# Altium schematic sheet cereal-sch.SchDoc: Cereal Schematics
size Tabloid; CheckedBy: elerner, jmpenny; Author: dnv; DocumentNumber: N/A; Revision: 1; SheetNumber: 2; SheetTotal: 2
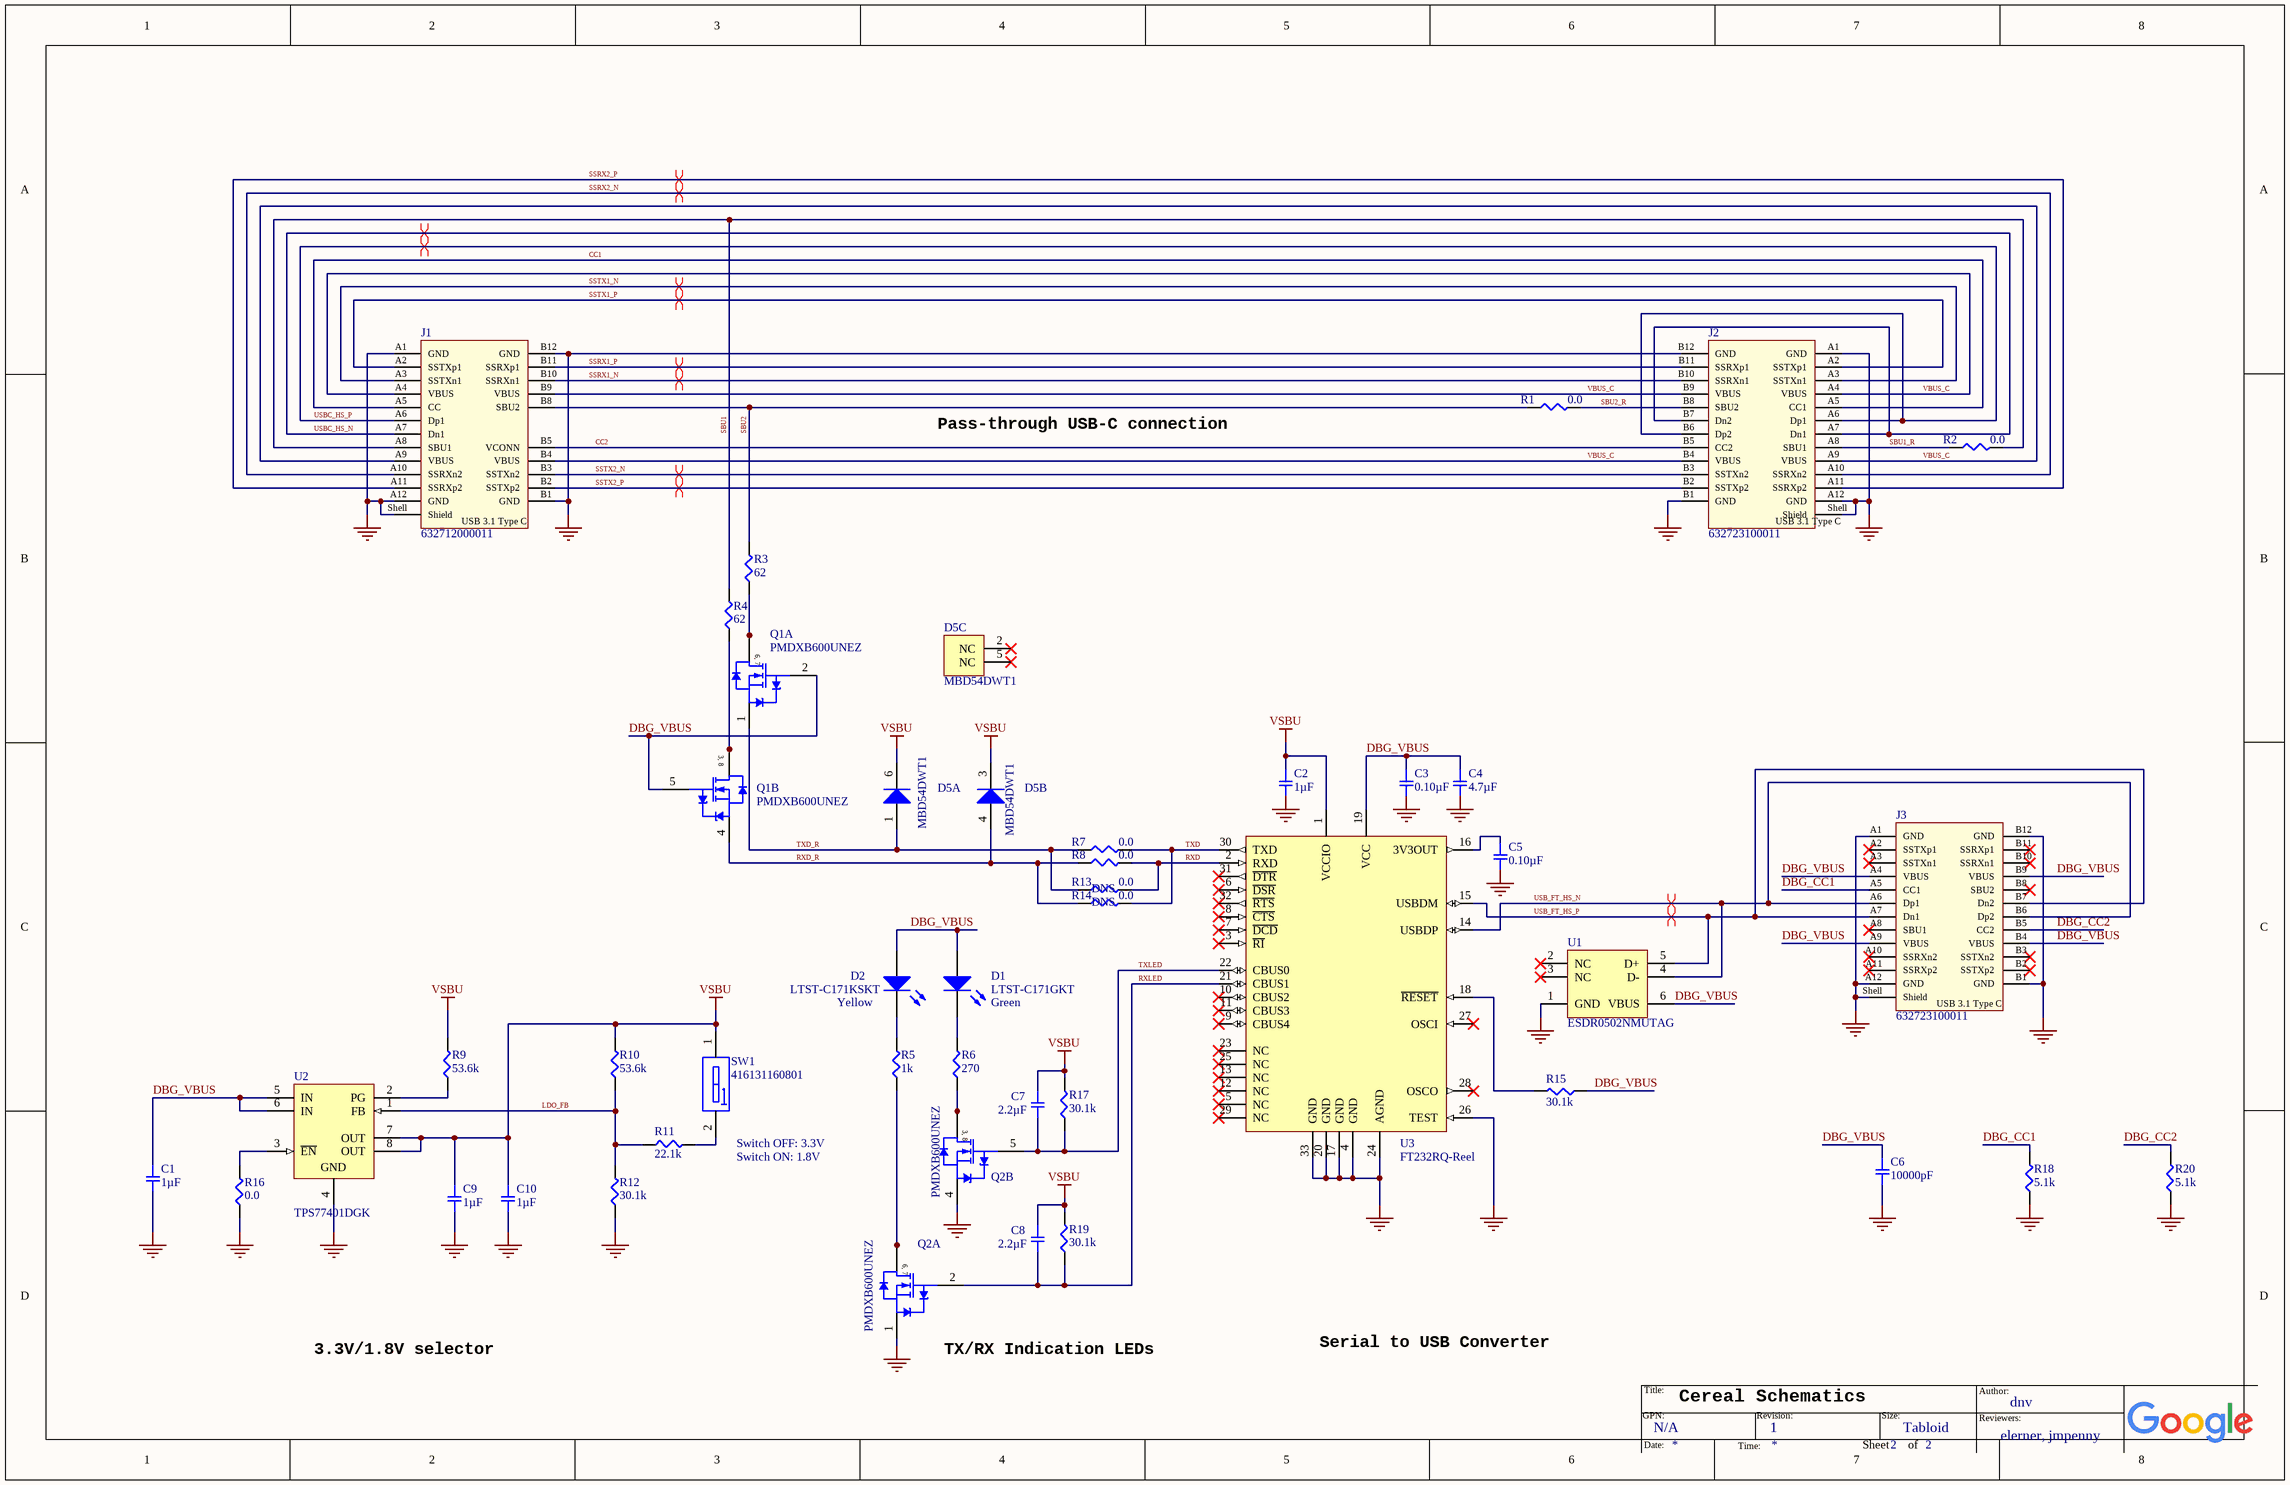
[diagram p0: cereal-sch.SchDoc]

## Parts
C1  1µF  [SMD-0201C]
C2  1µF  [SMD-0201C]
C3  0.10µF  [SMD-0201C]
C4  4.7µF  [SMD-0402C]
C5  0.10µF  [SMD-0201C]
C6  10000pF  [SMD-0201C]
C7  2.2µF  [SMD-0201C]
C8  2.2µF  [SMD-0201C]
C9  1µF  [SMD-0201C]
C10  1µF  [SMD-0201C]
D1  LTST-C171GKT  Color: Green  [0805]
D2  LTST-C171KSKT  Color: Yellow  [0805]
D5  MBD54DWT1  [ONSC-SOT-363-6-419B-02_W_V]  (parts A,B,C of 3)
J1  632712000011  [632712000011]
J2  632723100011  [632723100011]
J3  632723100011  [632723100011]
Q1  PMDXB600UNEZ  [NXP-SOT1216_N]  (parts A,B of 2)
Q2  PMDXB600UNEZ  [NXP-SOT1216_N]  (parts A,B of 2)
R1  0.0  [SMD-0201-RES]
R2  0.0  [SMD-0201-RES]
R3  62  [SMD-0402-RES]
R4  62  [SMD-0402-RES]
R5  1k  [SMD-0201-RES]
R6  270  [SMD-0201-RES]
R7  0.0  [SMD-0201-RES]
R8  0.0  [SMD-0201-RES]
R9  53.6k  [SMD-0201-RES]
R10  53.6k  [SMD-0201-RES]
R11  22.1k  [SMD-0201-RES]
R12  30.1k  [SMD-0201-RES]
R13  0.0  Populate: DNS  [SMD-0201-RES]
R14  0.0  Populate: DNS  [SMD-0201-RES]
R15  30.1k  [SMD-0201-RES]
R16  0.0  [SMD-0201-RES]
R17  30.1k  [SMD-0201-RES]
R18  5.1k  [SMD-0201-RES]
R19  30.1k  [SMD-0201-RES]
R20  5.1k  [SMD-0201-RES]
SW1  416131160801  [416131160801]
U1  ESDR0502NMUTAG  [ONSC-UDFN-6-517AA-01_V]
U2  TPS77401DGK  [TI-DGK8_N]
U3  FT232RQ-Reel  [PQFN5X5-32_V]

## Nets
GND: C1.2 C2.2 C3.2 C4.2 C5.2 C6.2 C9.2 C10.2 J1.A1(GND) J1.A12(GND) J1.B1(GND) J1.B12(GND) J1.Shell(Shield) J2.A1(GND) J2.A12(GND) J2.B1(GND) J2.B12(GND) J2.Shell(Shield) J3.A1(GND) J3.A12(GND) J3.B1(GND) J3.B12(GND) J3.Shell(Shield) Q2.1(S1) Q2.4(S2) R12.1 R16.1 R18.1 R20.1 U1.1(GND) U2.4(GND) U3.4(GND) U3.17(GND) U3.20(GND) U3.24(AGND) U3.26(TEST) U3.33(GND)
VSBU: C2.1 C7.1 C8.1 C9.1 C10.1 D5.3(K1) D5.6(K2) R9.2 R10.2 R17.2 R19.2 SW1.1 U2.7(OUT) U2.8(OUT) U3.1(VCCIO)
CC1: J1.A5(CC) J2.A5(CC1)
CC2: J1.B5(VCONN) J2.B5(CC2)
DBG_CC1: J3.A5(CC1) R18.2
DBG_CC2: J3.B5(CC2) R20.2
DBG_VBUS: C1.1 C3.1 C4.1 C6.1 D1.1(A) D2.1(A) J3.A4(VBUS) J3.A9(VBUS) J3.B4(VBUS) J3.B9(VBUS) Q1.2(G1) Q1.5(G2) R15.1 U1.6(VBUS) U2.5(IN) U2.6(IN) U3.19(VCC)
LDO_FB: R10.1 R11.1 R12.2 U2.1(FB)
RXD: R8.2 R13.2 U3.2(RXD)
RXD_R: D5.4(A1) Q1.4(S2) R8.1 R14.1
RXLED: C8.2 Q2.2(G1) R19.1 U3.21(CBUS1)
SBU1: J1.A8(SBU1) R2.2 R4.2
SBU1_R: J2.A8(SBU1) R2.1
SBU2: J1.B8(SBU2) R1.1 R3.2
SBU2_R: J2.B8(SBU2) R1.2
SSRX1_N: J1.B10(SSRXn1) J2.B10(SSRXn1)
SSRX1_P: J1.B11(SSRXp1) J2.B11(SSRXp1)
SSRX2_N: J1.A10(SSRXn2) J2.A10(SSRXn2)
SSRX2_P: J1.A11(SSRXp2) J2.A11(SSRXp2)
SSTX1_N: J1.A3(SSTXn1) J2.A3(SSTXn1)
SSTX1_P: J1.A2(SSTXp1) J2.A2(SSTXp1)
SSTX2_N: J1.B3(SSTXn2) J2.B3(SSTXn2)
SSTX2_P: J1.B2(SSTXp2) J2.B2(SSTXp2)
TXD: R7.2 R14.2 U3.30(TXD)
TXD_R: D5.1(A2) Q1.1(S1) R7.1 R13.1
TXLED: C7.2 Q2.5(G2) R17.1 U3.22(CBUS0)
USB_FT_HS_N: J3.A6(Dp1) J3.B6(Dp2) U1.4(D-) U3.14(USBDP)
USB_FT_HS_P: J3.A7(Dn1) J3.B7(Dn2) U1.5(D+) U3.15(USBDM)
USBC_HS_N: J1.A7(Dn1) J2.A7(Dn1) J2.B7(Dn2)
USBC_HS_P: J1.A6(Dp1) J2.A6(Dp1) J2.B6(Dp2)
VBUS_C: J1.A4(VBUS) J1.A9(VBUS) J1.B4(VBUS) J1.B9(VBUS) J2.A4(VBUS) J2.A9(VBUS) J2.B4(VBUS) J2.B9(VBUS)
NetC5_1: C5.1 U3.16(3V3OUT)
NetD1_2: D1.2(K) R6.2
NetD2_2: D2.2(K) R5.2
NetQ1_3: Q1.3(D2) Q1.8(D2) R4.1
NetQ1_6: Q1.6(D1) Q1.7(D1) R3.1
NetQ2_3: Q2.3(D2) Q2.8(D2) R6.1
NetQ2_6: Q2.6(D1) Q2.7(D1) R5.1
NetR9_1: R9.1 U2.2(PG)
NetR11_2: R11.2 SW1.2
NetR15_2: R15.2 U3.18(~{RESET})
NetR16_2: R16.2 U2.3(~{EN})

Not connected (* = marked no-connect by the designer): D5 2(NC)* 5(NC)*; J3 A2(SSTXp1)* A3(SSTXn1)* A8(SBU1)* A10(SSRXn2)* A11(SSRXp2)* B2(SSTXp2)* B3(SSTXn2)* B8(SBU2)* B10(SSRXn1)* B11(SSRXp1)*; U1 2(NC)* 3(NC)*; U3 3(~{RI})* 5(NC)* 6(~{DSR})* 7(~{DCD})* 8(~{CTS})* 9(CBUS4)* 10(CBUS2)* 11(CBUS3)* 12(NC)* 13(NC)* 23(NC)* 25(NC)* 27(OSCI)* 28(OSCO)* 29(NC)* 31(~{DTR})* 32(~{RTS})*

## Layout directives
differential pair: SSRX1_N, SSRX1_P, SSRX2_N, SSRX2_P, SSTX1_N, SSTX1_P, SSTX2_N, SSTX2_P, USB_FT_HS_N, USB_FT_HS_P, USBC_HS_N, USBC_HS_P

## Notes on the sheet
- Pass-through USB-C connection
- Switch OFF: 3.3V
- Switch ON: 1.8V
- 3.3V/1.8V selector
- (near Q2) TX/RX Indication LEDs
- Serial to USB Converter
- GPN:
- Title:
- Revision:
- Size:
- Tabloid
- Author:
- Reviewers:
- Date:
- Time:
- Sheet
- of
- (in symbol 632712000011) USB 3.1 Type C
- (in symbol 632723100011) USB 3.1 Type C
- (in symbol PMDXB600UNEZ, part A) 6, 7
- (in symbol PMDXB600UNEZ, part B) 3, 8

## Library data of the parts
C1 C2 C9 C10 = GRM033R60J105MEA2D: CAP CER 1UF 6.3V X5R 0201; Manufacturer: Murata Electronics North America; Factory Stock: 0; Unit Price (USD): 0.12; Minimum Quantity: 1; Tolerance: ±20%; Datasheets: http://www.murata.com/~/media/webrenewal/support/library/catalog/products/capacitor/mlcc/c02e.pdf; Image: //media.digikey.com/Renders/Murata%20Renders/ZRB-SERIES-0402.jpg; Digi-Key Part Number: 490-7229-1-ND; Part Number: GRM033R60J105MEA2D; Quantity Available: 223818; @ qty: 0; Packaging: Cut Tape (CT); Series: GRM; Part Status: Active; Value: 1µF; Voltage: 6.3V; Temperature Coefficient: X5R; Operating Temperature: -55°C ~ 85°C; Features: Derating Recommended; Ratings: -; Applications: General Purpose; Failure Rate: Surface Mount, MLCC; Mounting Type: 0201 (0603 Metric); Package / Case: 0.024" L x 0.012" W (0.60mm x 0.30mm); Size / Dimension: -; Height - Seated (Max): 0.013" (0.33mm); Thickness (Max): -; Lead Spacing: -
C3 C5 = GRM033R61A104KE15D: CAP CER 0.1UF 10V X5R 0201; Manufacturer: Murata Electronics North America; Factory Stock: 0; Unit Price (USD): 0.1; Minimum Quantity: 1; Tolerance: ±10%; Datasheets: http://www.murata.com/~/media/webrenewal/support/library/catalog/products/capacitor/mlcc/c02e.pdf; Image: //media.digikey.com/Renders/Murata%20Renders/ZRB-SERIES-0402.jpg; Digi-Key Part Number: 490-5881-1-ND; Part Number: GRM033R61A104KE15D; Quantity Available: 6540866; @ qty: 0; Packaging: Cut Tape (CT); Series: GRM; Part Status: Active; Value: 0.10µF; Voltage: 10V; Temperature Coefficient: X5R; Operating Temperature: -55°C ~ 85°C; Features: -; Ratings: -; Applications: General Purpose; Failure Rate: Surface Mount, MLCC; Mounting Type: 0201 (0603 Metric); Package / Case: 0.024" L x 0.012" W (0.60mm x 0.30mm); Size / Dimension: -; Height - Seated (Max): 0.013" (0.33mm); Thickness (Max): -; Lead Spacing: -
C4 = GRM153R60G475ME15D: CAP CER 4.7UF 4V X5R 0402; Manufacturer: Murata Electronics North America; Factory Stock: 0; Unit Price (USD): 0.27; Minimum Quantity: 1; Tolerance: ±20%; Datasheets: http://psearch.en.murata.com/capacitor/product/GRM153R60G475ME15%23.pdf; Image: //media.digikey.com/Renders/Murata%20Renders/ZRB-SERIES-0402.jpg; Digi-Key Part Number: 490-13231-1-ND; Part Number: GRM153R60G475ME15D; Quantity Available: 9100; @ qty: 0; Packaging: Cut Tape (CT); Series: GRM; Part Status: Active; Value: 4.7µF; Voltage: 4V; Temperature Coefficient: X5R; Operating Temperature: -55°C ~ 85°C; Features: -; Ratings: -; Applications: General Purpose; Mounting Type: Surface Mount, MLCC; Package / Case: 0402 (1005 Metric); Size / Dimension: 0.039" L x 0.020" W (1.00mm x 0.50mm); Height - Seated (Max): -; Thickness (Max): 0.013" (0.33mm); Lead Spacing: -; Lead Style: -
C6 = GRM033R61A103KA01J: CAP CER 10000PF 10V X5R 0201; Manufacturer: Murata Electronics North America; Factory Stock: 0; Unit Price (USD): 0.1; Minimum Quantity: 1; Tolerance: ±10%; Datasheets: http://www.murata.com/~/media/webrenewal/support/library/catalog/products/capacitor/mlcc/c02e.pdf; Image: //media.digikey.com/Renders/Murata%20Renders/ZRB-SERIES-0402.jpg; Digi-Key Part Number: 490-8156-1-ND; Part Number: GRM033R61A103KA01J; Quantity Available: 134975; @ qty: 0; Packaging: Cut Tape (CT); Series: GRM; Part Status: Active; Value: 10000pF; Voltage: 10V; Temperature Coefficient: X5R; Operating Temperature: -55°C ~ 85°C; Features: -; Ratings: -; Applications: General Purpose; Failure Rate: Surface Mount, MLCC; Mounting Type: 0201 (0603 Metric); Package / Case: 0.024" L x 0.012" W (0.60mm x 0.30mm); Size / Dimension: -; Height - Seated (Max): 0.013" (0.33mm); Thickness (Max): -; Lead Spacing: -
C7 C8 = GRM033R61A225KE47D: CAP CER 2.2UF 10V X5R 0201; Manufacturer: Murata Electronics North America; Factory Stock: 0; Unit Price (USD): 0.28; Minimum Quantity: 1; Tolerance: ±10%; Datasheets: http://www.murata.com/~/media/webrenewal/support/library/catalog/products/capacitor/mlcc/c02e.pdf; Image: //media.digikey.com/Renders/Murata%20Renders/ZRB-SERIES-0402.jpg; Digi-Key Part Number: 490-13227-1-ND; Part Number: GRM033R61A225KE47D; Quantity Available: 8; @ qty: 0; Packaging: Cut Tape (CT); Series: GRM; Part Status: Active; Value: 2.2µF; Voltage: 10V; Temperature Coefficient: X5R; Operating Temperature: -55°C ~ 85°C; Features: Derating Recommended; Ratings: -; Applications: General Purpose; Failure Rate: Surface Mount, MLCC; Mounting Type: 0201 (0603 Metric); Package / Case: 0.024" L x 0.012" W (0.60mm x 0.30mm); Size / Dimension: -; Height - Seated (Max): 0.015" (0.39mm); Thickness (Max): -; Lead Spacing: -
D1 = LTST-C171GKT: LED
D2 = LTST-C171KSKT: LED
D5 = MBD54DWT1: Dual Schottky Barrier Diodes, 6-Pin SOT-363, Tape and Reel; Manufacturer: On Semiconductor; IFSM Max (A): 0.6; trr Max (ns): 5; DatasheetVersion: Rev. 7; PackageVersion: Rev. W, 01/2006; PackageReference: SOT-363-6-419B-02_W; PackageDescription: 6-Pin Small Outline Transistor, Body 2 x 1.25 mm, Pitch 0.65 mm; Supplier 1: Digi-Key; Supplier Part Number 1: MBD54DWT1OSCT-ND; Configuration: Dual; Packing: Tape and Reel; RoHS: FALSE; Mounting Technology: Surface Mount; PartNumber: MBD54DWT1; ComponentLink1Description: Manufacturer URL; ComponentLink1URL: http://www.onsemi.com/; ComponentLink2Description: Datasheet; ComponentLink2URL: http://www.onsemi.cn/pub_link/Collateral/MBD54DWT1-D.PDF; ComponentLink3Description: Package Specification; ComponentLink3URL: http://www.onsemi.com/pub_link/Collateral/NTJD4001N-D.PDF
J1 = 632712000011: USB 3.1 Type C Plug Horizontal SMT WR-COM; Interface Type: Type C; Sub-Family: USB 3.1; ComponentLink1Description: Manufacturer; ComponentLink1URL: http://www.we-online.de; ComponentLink2Description: Datasheet; ComponentLink2URL: http://katalog.we-online.de/em/datasheet/632712000011.pdf; Part Number: 632712000011; Published Date: April 2017; Publisher: Wurth Elektronik; Gender: Plug; Type: Horizontal; Construction: SMT
J2 J3 = 632723100011: USB 3.1 Type C Receptacle Horizontal THR WR-COM; Interface Type: Type C; Sub-Family: USB 3.1; ComponentLink1Description: Manufacturer; ComponentLink1URL: http://www.we-online.de; ComponentLink2Description: Datasheet; ComponentLink2URL: http://katalog.we-online.de/em/datasheet/632723x00011.pdf; Part Number: 632723100011; Published Date: April 2017; Publisher: Wurth Elektronik; Gender: Receptacle; Type: Horizontal; Construction: THR
Q1 Q2 = PMDXB600UNEZ: Dual N-Channel Trench MOSFET, 20 V, 0.6 A, -55 to 150 degC, 8-Pin SOT1216; Manufacturer: NXP Semiconductors; Channel Type: N; Ciss [typ] (pF): 21.3; Coss [typ] (pF): 5.4; ID [max] (A): 0.6; VDS [max] (V): 20; VGSth [typ] (V): 0.7; DatasheetVersion: Rev. 1; PackageVersion: 13-03-06, 03/2013; PackageReference: SOT1216; PackageDescription: 6-Pin Small Outline No-Lead, Body 1.1 x 1 mm, Pitch 0.35 mm; Supplier 1: Digi-Key; Supplier Part Number 1: PMDXB600UNEZ-ND; Supplier 2: Newark; Supplier Part Number 2: 23X8428; Supplier 3: Mouser; Supplier Part Number 3: 771-PMDXB600UNEZ; Mounting Technology: Surface Mount; PartNumber: PMDXB600UNEZ; ComponentLink1Description: Manufacturer URL; ComponentLink1URL: http://www.nxp.com/; ComponentLink2Description: Datasheet; ComponentLink2URL: http://www.nxp.com/documents/data_sheet/PMDXB600UNE.pdf; ComponentLink3Description: Package Specification; ComponentLink3URL: http://www.nxp.com/documents/outline_drawing/sot1216_po.pdf
R1 R2 R7 R8 R13 R14 R16 = ERJ-1GN0R00C: RES SMD 0.0OHM JUMPER 1/20W 0201; Manufacturer: Panasonic Electronic Components; Factory Stock: 0; Unit Price (USD): 0.00864; @ qty: 1500; Minimum Quantity: 1; Power (Watts): 0.05W, 1/20W; Part Number: ERJ-1GN0R00C; Datasheets: http://industrial.panasonic.com/www-cgi/jvcr13pz.cgi?E+PZ+3+AOA0001+ERJ1GN0R00C+8+WW; Image: //media.digikey.com/Renders/Panasonic%20Renders/ERJ-0201%20Pkg.jpg; Digi-Key Part Number: P15979CT-ND; Quantity Available: 1815300; Packaging: Cut Tape (CT); Series: ERJ; Part Status: Active; Value: 0.0; Tolerance: Jumper; Composition: Thick Film; Features: Automotive AEC-Q200; Temperature Coefficient: -; Operating Temperature: -55°C ~ 125°C; Package / Case: 0201 (0603 Metric); Supplier Device Package: 0201; Size / Dimension: 0.024" L x 0.012" W (0.60mm x 0.30mm); Height - Seated (Max): 0.010" (0.26mm); Number of Terminations: 2; Failure Rate: -
R3 R4 = ERJ-2GEJ620X: RES SMD 62 OHM 5% 1/10W 0402; Manufacturer: Panasonic Electronic Components; Factory Stock: 0; Unit Price (USD): 0.00350; @ qty: 1500; Minimum Quantity: 1; Power (Watts): 0.1W, 1/10W; Temperature Coefficient: ±200ppm/°C; Part Number: ERJ-2GEJ620X; Datasheets: http://industrial.panasonic.com/www-cgi/jvcr13pz.cgi?E+PZ+3+AOA0001+ERJ2GEJ620X+7+WW; Image: //media.digikey.com/Photos/Panasonic%20Photos/ERJ-PA2-Series.jpg; Digi-Key Part Number: P62JCT-ND; Quantity Available: 429144; Packaging: Cut Tape (CT); Series: ERJ; Part Status: Active; Value: 62; Tolerance: ±5%; Composition: Thick Film; Features: Automotive AEC-Q200; Operating Temperature: -55°C ~ 155°C; Package / Case: 0402 (1005 Metric); Supplier Device Package: 0402; Size / Dimension: 0.039" L x 0.020" W (1.00mm x 0.50mm); Height - Seated (Max): 0.016" (0.40mm); Number of Terminations: 2; Failure Rate: -
R5 = ERJ-1GEF1001C: RES SMD 1K OHM 1% 1/20W 0201; Manufacturer: Panasonic Electronic Components; Factory Stock: 0; Unit Price (USD): 0.00933; @ qty: 1500; Minimum Quantity: 1; Power (Watts): 0.05W, 1/20W; Temperature Coefficient: ±200ppm/°C; Part Number: ERJ-1GEF1001C; Datasheets: //media.digikey.com/pdf/Data%20Sheets/Panasonic%20Resistors%20Thermistors%20PDFs/ERJ_G,R,E_Rev08.pdf; Image: //media.digikey.com/Renders/Panasonic%20Renders/ERJ-0201%20Pkg.jpg; Digi-Key Part Number: P1.00KABCT-ND; Quantity Available: 359548; Packaging: Cut Tape (CT); Series: ERJ; Part Status: Active; Value: 1k; Tolerance: ±1%; Composition: Thick Film; Features: -; Operating Temperature: -55°C ~ 125°C; Package / Case: 0201 (0603 Metric); Supplier Device Package: 0201; Size / Dimension: 0.024" L x 0.012" W (0.60mm x 0.30mm); Height - Seated (Max): 0.010" (0.26mm); Number of Terminations: 2; Failure Rate: -
R6 = ERJ-1GEF2700C: RES SMD 270 OHM 1% 1/20W 0201; Manufacturer: Panasonic Electronic Components; Factory Stock: 0; Unit Price (USD): 0.00933; @ qty: 1500; Minimum Quantity: 1; Power (Watts): 0.05W, 1/20W; Temperature Coefficient: ±200ppm/°C; Part Number: ERJ-1GEF2700C; Datasheets: //media.digikey.com/pdf/Data%20Sheets/Panasonic%20Resistors%20Thermistors%20PDFs/ERJ_G,R,E_Rev08.pdf; Image: //media.digikey.com/Renders/Panasonic%20Renders/ERJ-0201%20Pkg.jpg; Digi-Key Part Number: P270ABCT-ND; Quantity Available: 19115; Packaging: Cut Tape (CT); Series: ERJ; Part Status: Active; Value: 270; Tolerance: ±1%; Composition: Thick Film; Features: -; Operating Temperature: -55°C ~ 125°C; Package / Case: 0201 (0603 Metric); Supplier Device Package: 0201; Size / Dimension: 0.024" L x 0.012" W (0.60mm x 0.30mm); Height - Seated (Max): 0.010" (0.26mm); Number of Terminations: 2; Failure Rate: -
R9 R10 = ERJ-1GEF5362C: RES SMD 53.6K OHM 1% 1/20W 0201; Manufacturer: Panasonic Electronic Components; Factory Stock: 0; Unit Price (USD): 0.00933; @ qty: 1500; Minimum Quantity: 1; Power (Watts): 0.05W, 1/20W; Temperature Coefficient: ±200ppm/°C; Part Number: ERJ-1GEF5362C; Datasheets: //media.digikey.com/pdf/Data%20Sheets/Panasonic%20Resistors%20Thermistors%20PDFs/ERJ_G,R,E_Rev08.pdf; Image: //media.digikey.com/Renders/Panasonic%20Renders/ERJ-0201%20Pkg.jpg; Digi-Key Part Number: P53.6KABCT-ND; Quantity Available: 73542; Packaging: Cut Tape (CT); Series: ERJ; Part Status: Active; Value: 53.6k; Tolerance: ±1%; Composition: Thick Film; Features: -; Operating Temperature: -55°C ~ 125°C; Package / Case: 0201 (0603 Metric); Supplier Device Package: 0201; Size / Dimension: 0.024" L x 0.012" W (0.60mm x 0.30mm); Height - Seated (Max): 0.010" (0.26mm); Number of Terminations: 2; Failure Rate: -
R11 = ERJ-1GEF2212C: RES SMD 22.1K OHM 1% 1/20W 0201; Manufacturer: Panasonic Electronic Components; Factory Stock: 0; Unit Price (USD): 0.00933; @ qty: 1500; Minimum Quantity: 1; Power (Watts): 0.05W, 1/20W; Temperature Coefficient: ±200ppm/°C; Part Number: ERJ-1GEF2212C; Datasheets: //media.digikey.com/pdf/Data%20Sheets/Panasonic%20Resistors%20Thermistors%20PDFs/ERJ_G,R,E_Rev08.pdf; Image: //media.digikey.com/Renders/Panasonic%20Renders/ERJ-0201%20Pkg.jpg; Digi-Key Part Number: P22.1KABCT-ND; Quantity Available: 91674; Packaging: Cut Tape (CT); Series: ERJ; Part Status: Active; Value: 22.1k; Tolerance: ±1%; Composition: Thick Film; Features: -; Operating Temperature: -55°C ~ 125°C; Package / Case: 0201 (0603 Metric); Supplier Device Package: 0201; Size / Dimension: 0.024" L x 0.012" W (0.60mm x 0.30mm); Height - Seated (Max): 0.010" (0.26mm); Number of Terminations: 2; Failure Rate: -
R12 R15 R17 R19 = ERJ-1GEF3012C: RES SMD 30.1K OHM 1% 1/20W 0201; Manufacturer: Panasonic Electronic Components; Factory Stock: 0; Unit Price (USD): 0.00933; @ qty: 1500; Minimum Quantity: 1; Power (Watts): 0.05W, 1/20W; Temperature Coefficient: ±200ppm/°C; Part Number: ERJ-1GEF3012C; Datasheets: //media.digikey.com/pdf/Data%20Sheets/Panasonic%20Resistors%20Thermistors%20PDFs/ERJ_G,R,E_Rev08.pdf; Image: //media.digikey.com/Renders/Panasonic%20Renders/ERJ-0201%20Pkg.jpg; Digi-Key Part Number: P30.1KABCT-ND; Quantity Available: 121183; Packaging: Cut Tape (CT); Series: ERJ; Part Status: Active; Value: 30.1k; Tolerance: ±1%; Composition: Thick Film; Features: -; Operating Temperature: -55°C ~ 125°C; Package / Case: 0201 (0603 Metric); Supplier Device Package: 0201; Size / Dimension: 0.024" L x 0.012" W (0.60mm x 0.30mm); Height - Seated (Max): 0.010" (0.26mm); Number of Terminations: 2; Failure Rate: -
R18 R20 = ERJ-1GEF5101C: RES SMD 5.1K OHM 1% 1/20W 0201; Manufacturer: Panasonic Electronic Components; Factory Stock: 0; Unit Price (USD): 0.00933; @ qty: 1500; Minimum Quantity: 1; Power (Watts): 0.05W, 1/20W; Temperature Coefficient: ±200ppm/°C; Part Number: ERJ-1GEF5101C; Datasheets: //media.digikey.com/pdf/Data%20Sheets/Panasonic%20Resistors%20Thermistors%20PDFs/ERJ_G,R,E_Rev08.pdf; Image: //media.digikey.com/Renders/Panasonic%20Renders/ERJ-0201%20Pkg.jpg; Digi-Key Part Number: P5.10KABCT-ND; Quantity Available: 106914; Packaging: Cut Tape (CT); Series: ERJ; Part Status: Active; Value: 5.1k; Tolerance: ±1%; Composition: Thick Film; Features: -; Operating Temperature: -55°C ~ 125°C; Package / Case: 0201 (0603 Metric); Supplier Device Package: 0201; Size / Dimension: 0.024" L x 0.012" W (0.60mm x 0.30mm); Height - Seated (Max): 0.010" (0.26mm); Number of Terminations: 2; Failure Rate: -
SW1 = 416131160801: WS-DISV 1.27 mm small compact SMD Dip Switch with top tape; NoPins: 02; PackageReference: 416131160801; PartNumber: 416131160801; ComponentLink1Description: Manufacturer URL; ComponentLink1URL: http://www.we-online.com; ComponentLink2Description: Datasheet; ComponentLink2URL: http://katalog.we-online.de/em/datasheet/4161311608xx.pdf
U1 = ESDR0502NMUTAG: Ultra Low Capacitance ESD Protection Array for High Speed Data Line Protection, 6-Pin UDFN, Pb-Free, Tape and Reel; Manufacturer: On Semiconductor; C Max (pF): 0.6; Direction: Unidirectional; IR Max (uA): 1; Number of Lines: 4; PPK Max (W): 100; V(BR) Min (V): 6; VRWM Max (V): 5.5; DatasheetVersion: Rev. 4; PackageVersion: Rev. D, 09/2010; PackageReference: UDFN-6-517AA-01; PackageDescription: 6-Pin Small Outline No-Lead, Body 1.2 x 1 mm, Pitch 0.4 mm; Supplier 1: Newark; Supplier Part Number 1: 92T2061; Supplier 2: Mouser; Supplier Part Number 2: 863-ESDR0502NMUTAG; Packing: Tape and Reel; RoHS: Pb-Free; Mounting Technology: Surface Mount; PartNumber: ESDR0502NMUTAG; ComponentLink1Description: Manufacturer URL; ComponentLink1URL: http://www.onsemi.com/; ComponentLink2Description: Datasheet; ComponentLink2URL: http://www.onsemi.cn/pub_link/Collateral/ESDR0502N-D.PDF; ComponentLink3Description: Package Specification; ComponentLink3URL: http://www.onsemi.com/pub_link/Collateral/517AA.PDF
U2 = TPS77401DGK: Single Output Fast Transient Response LDO, 250 mA, Adjustable 1.5 to 5.5 V Output, 2.7 to 10 V Input, with Power Good Output, 8-pin MSOP (DGK), -40 to 125 degC, Green (RoHS & no Sb/Br); Manufacturer: Texas Instruments; Accuracy(%): 2; Iout(Max)(A): 0.25; Iq(Typ)(mA): 0.09; Power Good: TRUE; SubFamily: Single Channel LDO; Vdo(Typ)(mV): 200; Vin(Max)(V): 10; Vin(Min)(V): 2.7; Vout Adj(Max)(V): 5.5; Vout Adj(Min)(V): 1.5; DatasheetVersion: SLVS281E; PackageVersion: 4073329/E; PackageReference: DGK8; PackageDescription: 8-Pin Thin Small Outline Package 3 x 3 mm Body ,0.65 mm Pitch; Supplier 1: Digi-Key; Supplier Part Number 1: 296-8115-5-ND; Supplier 2: Newark; Supplier Part Number 2: 77C1228; Supplier 3: Mouser; Supplier Part Number 3: 595-TPS77401DGK; Eco-Plan: Green (RoHS & no Sb/Br); Mounting Technology: Surface Mount; Code_JEDEC: MO-187; PartNumber: TPS77401DGK; ComponentLink1Description: Manufacturer URL; ComponentLink1URL: http://www.ti.com/; ComponentLink2Description: Datasheet; ComponentLink2URL: http://www.ti.com/general/docs/lit/getliterature.tsp?genericPartNumber=TPS77401&fileType=pdf; ComponentLink3Description: Package Specification; ComponentLink3URL: http://www.ti.com/litv/pdf/mpds028d
U3 = FT232RQ-Reel: USB UART Asynchronous Serial Data Transfer Chip, 32-pin QFN, Tape and Reel; Manufacturer: FTDI; DatasheetVersion: ver 2.10, Mar-2012; PackageVersion: Mar-12; PackageReference: PQFN5X5-32; PackageDescription: 32-Pin Quad Flat No-Lead 0.5 mm Pitch, Pullback, 3.2 x 3.2 mm Exposed Pad; PartNumber: FT232RQ-Reel; ComponentLink1Description: Manufacturer URL; ComponentLink1URL: http://www.ftdichip.com/; ComponentLink2Description: Datasheet; ComponentLink2URL: http://www.ftdichip.com/Support/Documents/DataSheets/ICs/DS_FT232R.pdf